# EAGLE design rgb (EAGLE 6.3)
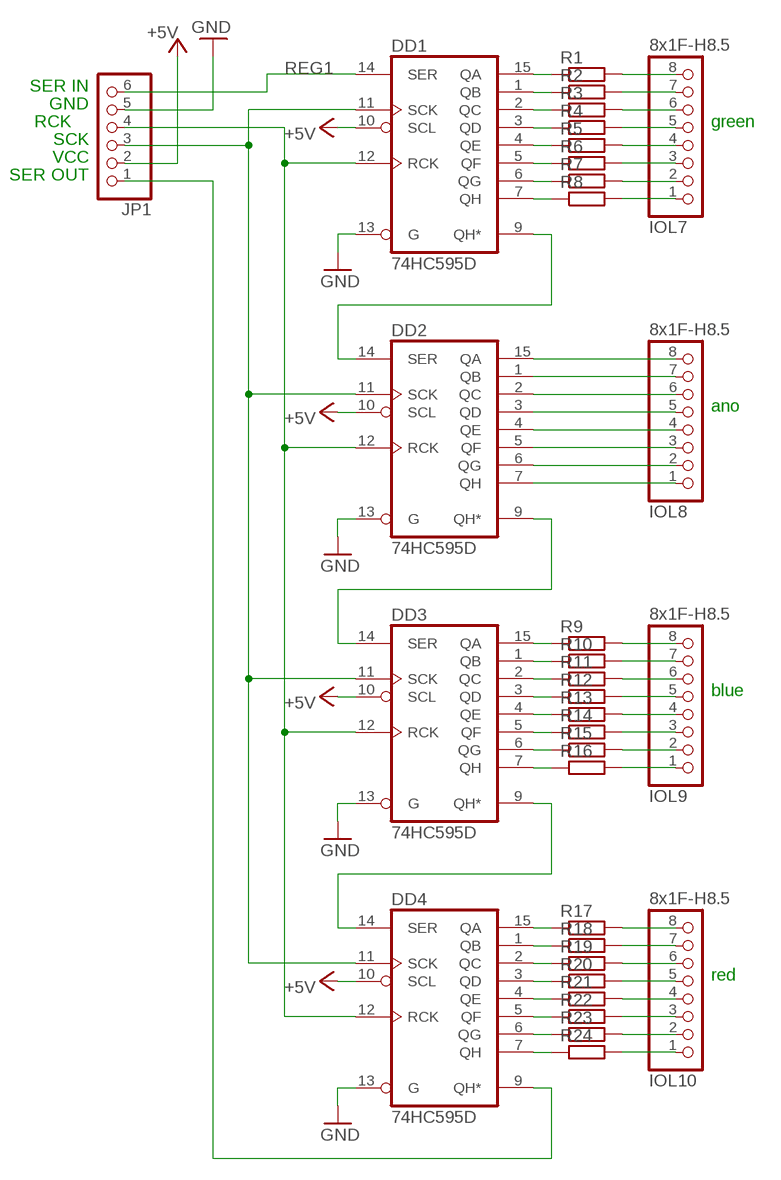
[diagram p0: schematic, sheet 1]

## Parts
DD1  74HC595D  [SO16]
DD2  74HC595D  [SO16]
DD3  74HC595D  [SO16]
DD4  74HC595D  [SO16]
IOL7  8x1F-H8.5  PINHD-1X8  [1X08]
IOL8  8x1F-H8.5  PINHD-1X8  [1X08]
IOL9  8x1F-H8.5  PINHD-1X8  [1X08]
IOL10  8x1F-H8.5  PINHD-1X8  [1X08]
JP1  PINHD-1X6  [1X06]
R1  R-EU_R0805  [R0805]
R2  R-EU_R0805  [R0805]
R3  R-EU_R0805  [R0805]
R4  R-EU_R0805  [R0805]
R5  R-EU_R0805  [R0805]
R6  R-EU_R0805  [R0805]
R7  R-EU_R0805  [R0805]
R8  R-EU_R0805  [R0805]
R9  R-EU_R0805  [R0805]
R10  R-EU_R0805  [R0805]
R11  R-EU_R0805  [R0805]
R12  R-EU_R0805  [R0805]
R13  R-EU_R0805  [R0805]
R14  R-EU_R0805  [R0805]
R15  R-EU_R0805  [R0805]
R16  R-EU_R0805  [R0805]
R17  R-EU_R0805  [R0805]
R18  R-EU_R0805  [R0805]
R19  R-EU_R0805  [R0805]
R20  R-EU_R0805  [R0805]
R21  R-EU_R0805  [R0805]
R22  R-EU_R0805  [R0805]
R23  R-EU_R0805  [R0805]
R24  R-EU_R0805  [R0805]

## Nets
+5V: DD1.10(SCL) DD2.10(SCL) DD3.10(SCL) DD4.10(SCL) JP1.2
GND: DD1.13(G) DD2.13(G) DD3.13(G) DD4.13(G) JP1.5
N$1: DD1.15(QA) R1.1
N$2: DD1.1(QB) R2.1
N$3: DD1.2(QC) R3.1
N$4: DD1.3(QD) R4.1
N$5: DD1.4(QE) R5.1
N$6: DD1.5(QF) R6.1
N$7: DD1.6(QG) R7.1
N$8: DD1.7(QH) R8.1
N$9: DD3.15(QA) R9.1
N$10: DD3.1(QB) R10.1
N$11: DD3.2(QC) R11.1
N$12: DD3.3(QD) R12.1
N$13: DD3.4(QE) R13.1
N$14: DD3.5(QF) R14.1
N$15: DD3.6(QG) R15.1
N$16: DD3.7(QH) R16.1
N$17: DD4.15(QA) R17.1
N$18: DD4.1(QB) R18.1
N$19: DD4.2(QC) R19.1
N$20: DD4.3(QD) R20.1
N$21: DD4.4(QE) R21.1
N$22: DD4.5(QF) R22.1
N$23: DD4.6(QG) R23.1
N$24: DD4.7(QH) R24.1
N$25: IOL7.8 R1.2
N$26: IOL7.7 R2.2
N$27: DD2.15(QA) IOL8.8
N$28: DD2.1(QB) IOL8.7
N$29: DD2.2(QC) IOL8.6
N$30: DD1.9(QH*) DD2.14(SER)
N$31: DD2.3(QD) IOL8.5
N$32: DD2.4(QE) IOL8.4
N$33: DD2.5(QF) IOL8.3
N$34: DD2.6(QG) IOL8.2
N$35: DD2.7(QH) IOL8.1
N$36: IOL7.6 R3.2
N$37: IOL7.5 R4.2
N$38: IOL7.4 R5.2
N$39: IOL7.3 R6.2
N$40: IOL7.2 R7.2
N$41: IOL7.1 R8.2
N$42: IOL9.8 R9.2
N$43: IOL9.7 R10.2
N$44: IOL9.6 R11.2
N$45: IOL9.5 R12.2
N$46: IOL9.4 R13.2
N$47: IOL9.3 R14.2
N$48: IOL9.2 R15.2
N$49: IOL9.1 R16.2
N$50: IOL10.8 R17.2
N$51: IOL10.7 R18.2
N$52: IOL10.6 R19.2
N$53: IOL10.5 R20.2
N$54: IOL10.4 R21.2
N$55: IOL10.3 R22.2
N$56: IOL10.2 R23.2
N$57: IOL10.1 R24.2
N$59: DD4.9(QH*) JP1.1
N$139: DD1.11(SCK) DD2.11(SCK) DD3.11(SCK) DD4.11(SCK) JP1.3
N$140: DD1.12(RCK) DD2.12(RCK) DD3.12(RCK) DD4.12(RCK) JP1.4
N$141: DD2.9(QH*) DD3.14(SER)
N$142: DD3.9(QH*) DD4.14(SER)
REG1: DD1.14(SER) JP1.6

## Notes on the sheet
- SER IN
- GND
- RCK | green
- SCK
- VCC
- SER OUT
- ano
- blue
- red

## Power pins joined to a net without a drawn wire
GND: DD1.8(GND) DD2.8(GND) DD3.8(GND) DD4.8(GND)
VCC: DD1.16(VCC) DD2.16(VCC) DD3.16(VCC) DD4.16(VCC)

## Library data of the parts
DD1-DD4 = 74xx-eu:74*595: 8-bit SHIFT REGISTER, output latch
IOL7-IOL10 = SmartPrj:PINHD-1X8: PIN HEADER
JP1 = pinhead:PINHD-1X6: PIN HEADER
R1-R24 = rcl:R-EU_: RESISTOR, European symbol

## Net classes
1 power: width 0.254 mm, drill 0.61 mm, clearance 0.254 mm
2 gnd: width 0.305 mm, drill 0.559 mm, clearance 0.254 mm
4 aref: width 0.254 mm, drill 0.61 mm, clearance 0.254 mm

## Board
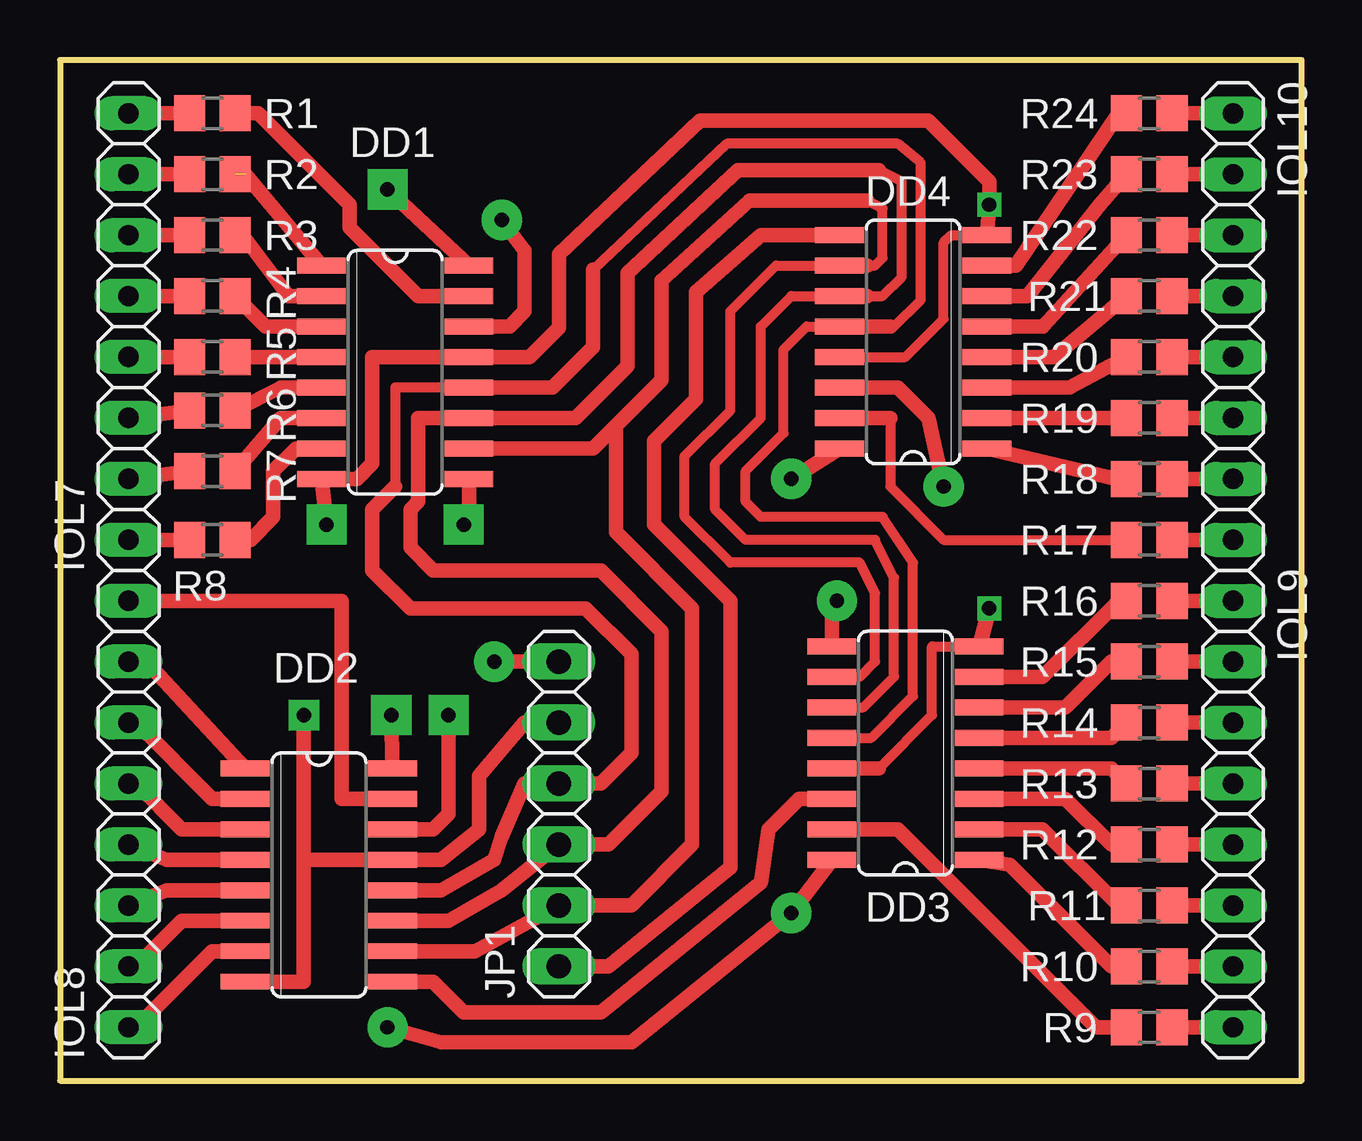
[diagram p1: board, top side]
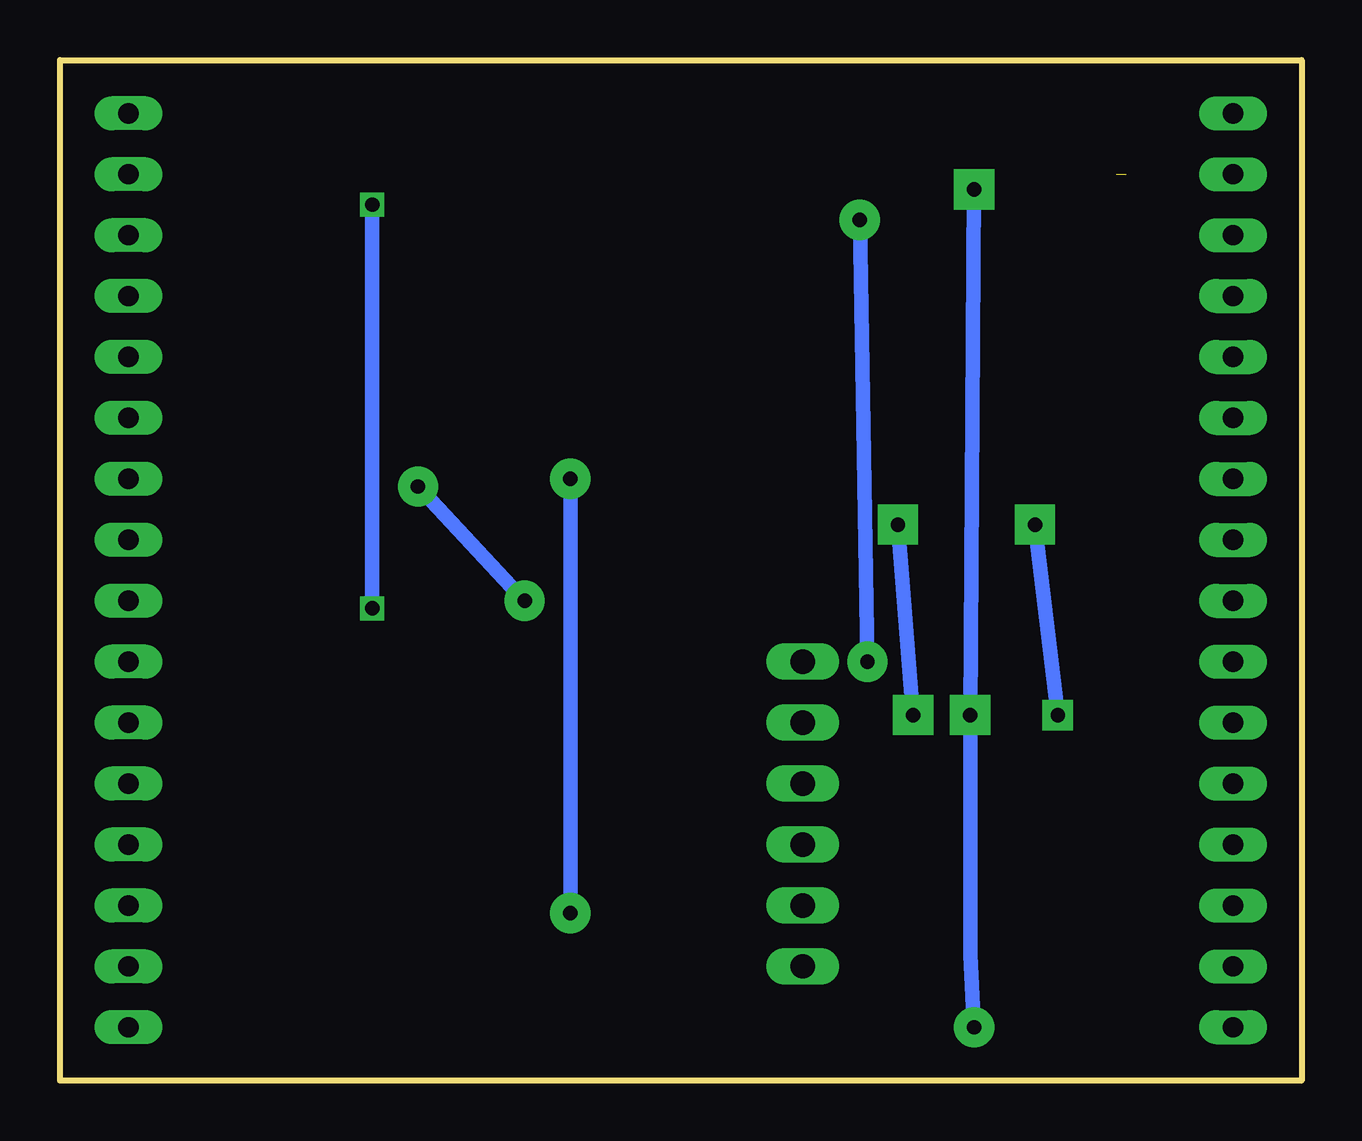
[diagram p2: board, bottom side, seen from below]

Size 51.75 x 42.54 mm. Coordinates in mm from the lower left corner, seen from the top.
Outline: 0,42.54 0,0 51.75,0 51.75,42.54 0,42.54
Copper layers (1*16): Top 0.035mm / dielectric 1.5mm / Bottom 0.035mm
Design rules "default": minimum track width 10mil, minimum drill 24mil, track to track 8mil, track to pad 8mil, pad to pad 8mil, via to via 8mil, smd to smd 8mil, copper to edge 40mil, drill to drill 8mil, minimum pad ring 10mil, minimum via ring 8mil, stop-mask expansion 4mil, vias tented up to drill 0mil, thermal gap 10mil

### Footprints (pad centres in the part's own frame; a part is rotated, then mirrored left to right if it is on the bottom)
SO16 = smd 0.66 x 2.032: 1 -4.445,-3.073; 2 -3.175,-3.073; 3 -1.905,-3.073; 4 -0.635,-3.073; 5 0.635,-3.073; 6 1.905,-3.073; 7 3.175,-3.073; 8 4.445,-3.073; 9 4.445,3.073; 10 3.175,3.073; 11 1.905,3.073; 12 0.635,3.073; 13 -0.635,3.073; 14 -1.905,3.073; 15 -3.175,3.073; 16 -4.445,3.073
1X08 = drill 0.85 pad 1.422 long: 1 -8.89,0; 2 -6.35,0; 3 -3.81,0; 4 -1.27,0; 5 1.27,0; 6 3.81,0; 7 6.35,0; 8 8.89,0
1X06 = drill 1.016 long: 1 -6.35,0; 2 -3.81,0; 3 -1.27,0; 4 1.27,0; 5 3.81,0; 6 6.35,0
R0805 = smd 1.3 x 1.5: 1 -0.95,0; 2 0.95,0

### Placement (x,y rotation side)
DD1  13.97,29.53 270 top
DD2  10.79,8.57 270 top
DD3  35.24,13.65 90 top
DD4  35.56,30.8 90 top
IOL7  2.86,31.43 90 top
IOL8  2.86,11.11 90 top
IOL9  48.89,11.11 270 top
IOL10  48.89,31.43 270 top
JP1  20.8,11.11 90 top
R1  6.35,40.32 180 top
R2  6.35,37.78 180 top
R3  6.35,35.24 180 top
R4  6.35,32.7 180 top
R5  6.35,30.16 180 top
R6  6.35,27.94 180 top
R7  6.35,25.4 180 top
R8  6.35,22.54 180 top
R9  45.4,2.22 0 top
R10  45.4,4.76 0 top
R11  45.4,7.3 0 top
R12  45.4,9.84 0 top
R13  45.4,12.38 0 top
R14  45.4,14.92 0 top
R15  45.4,17.46 0 top
R16  45.4,20 0 top
R17  45.4,22.54 0 top
R18  45.4,25.08 0 top
R19  45.4,27.62 0 top
R20  45.4,30.16 0 top
R21  45.4,32.7 0 top
R22  45.4,35.24 0 top
R23  45.4,37.78 0 top
R24  45.4,40.32 0 top

### Tracks (layer width: path | path; a pad name or v marks a point on that pad's centre or on a via)
+5V
  Top 0.406: 33.66,33.97 33.97,33.97 34.29,34.29 34.29,36.35 33.66,36.67 | DD3.10 33.34,16.83 33.97,17.46 33.97,20.32 33.34,21.59 27.94,21.59 26.03,23.5 26.03,26.03 27.94,27.94 27.94,32.07 29.84,33.97 DD4.10
  Top 0.61: DD2.10 17.3,5.4 JP1.2 23.81,7.3 26.35,9.84 26.35,19.69 23.18,22.86 23.18,27.31 | DD4.10 33.66,33.97 | 33.66,36.67 28.73,36.67 25.08,33.34 25.08,29.21 23.18,27.31 | DD1.10 22.22,26.35 23.18,27.31
GND  (via drill 0.6, 0.6 pad 1.27, 0.6 pad 1.68)
  Top 0.406: 34.13,13.02 36.35,15.24 36.35,18.1 DD3.8 38.42,18.1 | DD4.13 35.24,30.16 36.83,31.75 36.83,34.92 37.15,35.24 DD4.8
  Top 0.61: DD2.8 10.16,4.13 10.16,9.21 | 10.16,9.21 DD2.13 15.88,9.21 17.46,10.48 17.46,12.7 19.37,14.92 JP1.5 | 34.13,13.02 DD3.13 | v11.11,23.18 DD1.8 12.38,25.08 13.02,25.72 13.02,30.16 DD1.13 19.58,30.16 20.8,31.38 20.8,34.45 26.67,40 36.19,40 38.74,37.47 v38.74,36.51 DD4.8 | v38.74,19.69 DD3.8 | v10.16,15.24 10.16,9.21
  Bottom 0.61: v11.11,23.18 v10.16,15.24 | v38.74,19.69 v38.74,36.51
N$1
  Top 0.61: DD1.15 14.92,32.7 12.06,35.56 12.06,36.51 8.25,40.32 R1.1
N$2  (1 unrouted)
  Top 0.61: DD1.1 7.72,37.78
N$3
  Top 0.61: DD1.2 9.53,32.7 7.62,35.24 R3.1
N$4
  Top 0.61: DD1.3 8.57,31.43 R4.1
N$5
  Top 0.61: DD1.4 R5.1
N$6
  Top 0.61: DD1.5 9.2,28.89 R6.1
N$7
  Top 0.61: DD1.6 9.21,27.62 R7.1
N$8
  Top 0.61: 7.62,22.54 R8.1 7.94,22.54 8.89,23.5 8.89,25.4 9.84,26.35 DD1.7
N$9
  Top 0.61: DD3.15 34.92,10.48 43.18,2.22 R9.1
N$10
  Top 0.61: DD3.1 39.59,8.99 43.81,4.76 R10.1
N$11
  Top 0.61: DD3.2 40.96,10.48 44.13,7.3 R11.1
N$12
  Top 0.61: DD3.3 41.91,11.75 43.81,9.84 R12.1
N$13
  Top 0.61: DD3.4 43.82,13.02 R13.1
N$14
  Top 0.61: DD3.5 43.82,14.29 R14.1
N$15
  Top 0.61: DD3.6 41.91,15.56 43.81,17.46 R15.1
N$16
  Top 0.61: DD3.7 40.96,16.83 44.13,20 R16.1
N$17
  Top 0.406: 34.61,27.62 34.61,24.76 36.83,22.54 R17.1
  Top 0.61: DD4.15 34.61,27.62
N$18
  Top 0.61: DD4.1 44.03,25.08 R18.1
N$19
  Top 0.61: DD4.2 R19.1
N$20
  Top 0.61: DD4.3 42.07,28.89 R20.1
N$21
  Top 0.61: DD4.4 41.44,30.16 R21.1
N$22
  Top 0.61: DD4.5 40.96,31.43 R22.1
N$23
  Top 0.61: DD4.6 40.32,32.7 43.34,36.51 R23.1
N$24
  Top 0.61: DD4.7 39.85,33.97 44.13,40.32 R24.1
N$25
  Top 0.61: R1.2 IOL7.8
N$26
  Top 0.61: R2.2 IOL7.7
N$27
  Top 0.61: DD2.15 11.75,11.75 11.75,20 IOL8.8
N$28
  Top 0.61: IOL8.7 3.59,17.46 DD2.1
N$29
  Top 0.61: DD2.2 6.35,11.75 3.17,14.92 IOL8.6
N$30  (via drill 0.6 pad 1.68)
  Top 0.61: v16.19,15.24 16.19,11.11 15.56,10.48 DD2.14 | DD1.9 17.04,23.71 v16.83,23.18
  Bottom 0.61: v16.83,23.18 v16.19,15.24
N$31
  Top 0.61: DD2.3 5.08,10.48 3.17,12.38 IOL8.5
N$32
  Top 0.61: DD2.4 4.44,9.21 IOL8.4
N$33
  Top 0.61: DD2.5 4.44,7.94 IOL8.3
N$34
  Top 0.61: DD2.6 5.08,6.67 3.17,4.76 IOL8.2
N$35
  Top 0.61: DD2.7 6.35,5.4 3.17,2.22 IOL8.1
N$36
  Top 0.61: R3.2 IOL7.6
N$37
  Top 0.61: R4.2 IOL7.5
N$38
  Top 0.61: R5.2 IOL7.4
N$39
  Top 0.61: R6.2 IOL7.3
N$40
  Top 0.61: R7.2 IOL7.2
N$41
  Top 0.61: R8.2 IOL7.1
N$42
  Top 0.61: R9.2 IOL9.8
N$43
  Top 0.61: R10.2 IOL9.7
N$44
  Top 0.61: R11.2 IOL9.6
N$45
  Top 0.61: R12.2 IOL9.5
N$46
  Top 0.61: R13.2 IOL9.4
N$47
  Top 0.61: R14.2 IOL9.3
N$48
  Top 0.61: R15.2 IOL9.2
N$49
  Top 0.61: R16.2 IOL9.1
N$50
  Top 0.61: R17.2 IOL10.8
N$51
  Top 0.61: R18.2 IOL10.7
N$52
  Top 0.61: R19.2 IOL10.6
N$53
  Top 0.61: R20.2 IOL10.5
N$54
  Top 0.61: R21.2 IOL10.4
N$55
  Top 0.61: R22.2 IOL10.3
N$56
  Top 0.61: R23.2 IOL10.2
N$57
  Top 0.61: R24.2 IOL10.1
N$59
  Top 0.61: DD4.9 29.21,35.24 26.51,32.86 26.51,28.42 24.76,26.67 24.76,23.18 27.94,20 27.94,8.89 22.86,4.76 JP1.1
N$139
  Top 0.406: 33.66,32.7 34.29,32.7 35.08,33.5 35.08,37.47 34.13,37.94 | DD3.11 33.5,15.56 34.77,16.83 34.77,20.95 33.97,22.54 28.57,22.54 27.31,23.81 27.31,25.72 29.21,27.62 29.21,31.43 30.48,32.7 DD4.11
  Top 0.61: DD2.11 16.19,6.67 18.41,7.94 JP1.3 22.86,9.84 25.08,12.06 25.08,18.73 22.54,21.27 15.56,21.27 14.6,22.22 14.6,23.81 14.92,24.13 14.92,27.62 DD1.11 21.48,27.62 23.65,29.79 23.65,33.66 28.26,37.94 34.13,37.94 | DD4.11 33.66,32.7
N$140
  Top 0.406: 34.61,31.43 34.77,31.43 35.88,32.54 35.88,38.26 34.92,39.05 27.78,39.05 22.22,33.81 | DD1.12 13.97,28.89 13.97,24.76 | DD3.12 33.81,14.29 35.56,16.03 35.56,21.59 34.29,23.5 29.21,23.5 28.57,24.13 28.57,25.4 30.16,26.99 30.16,30.48 31.11,31.43 DD4.12
  Top 0.61: DD4.12 34.61,31.43 | DD2.12 15.88,7.94 18.1,9.21 18.41,10.16 19.37,12.38 JP1.4 22.54,12.38 23.81,13.65 23.81,17.78 21.91,19.69 14.6,19.69 13.02,21.27 13.02,23.81 13.97,24.76 | DD1.12 20.53,28.89 22.22,30.58 22.22,33.81
N$141
  Top 0.61: DD3.14 30.8,11.75 29.53,10.48 29.21,8.25 22.54,2.86 16.83,2.86 15.56,4.13 DD2.9
N$142  (via drill 0.6 pad 1.68)
  Top 0.61: v32.38,20 32.17,20 DD3.9 | DD4.14 34.92,28.89 36.19,27.62 v36.83,24.76
  Bottom 0.61: v36.83,24.76 v32.38,20
REG1  (via drill 0.6 pad 1.68)
  Top 0.61: DD1.14 18.73,31.43 19.37,32.07 19.37,34.61 v18.41,35.88 | v18.1,17.46 JP1.6
  Bottom 0.61: v18.41,35.88 v18.1,17.46
VCC  (via drill 0.6 pad 1.68)
  Top 0.61: DD1.16 v13.65,37.15 | v13.81,15.24 DD2.16 | DD3.16 v30.48,6.98 23.81,1.59 15.88,1.59 v13.65,2.22 | v30.48,25.08 DD4.16
  Bottom 0.61: v30.48,6.98 v30.48,25.08 | v13.65,37.15 v13.81,15.24 13.81,5.24 v13.65,2.22